# Altium schematic sheet Main_V1.1.SchDoc
size B
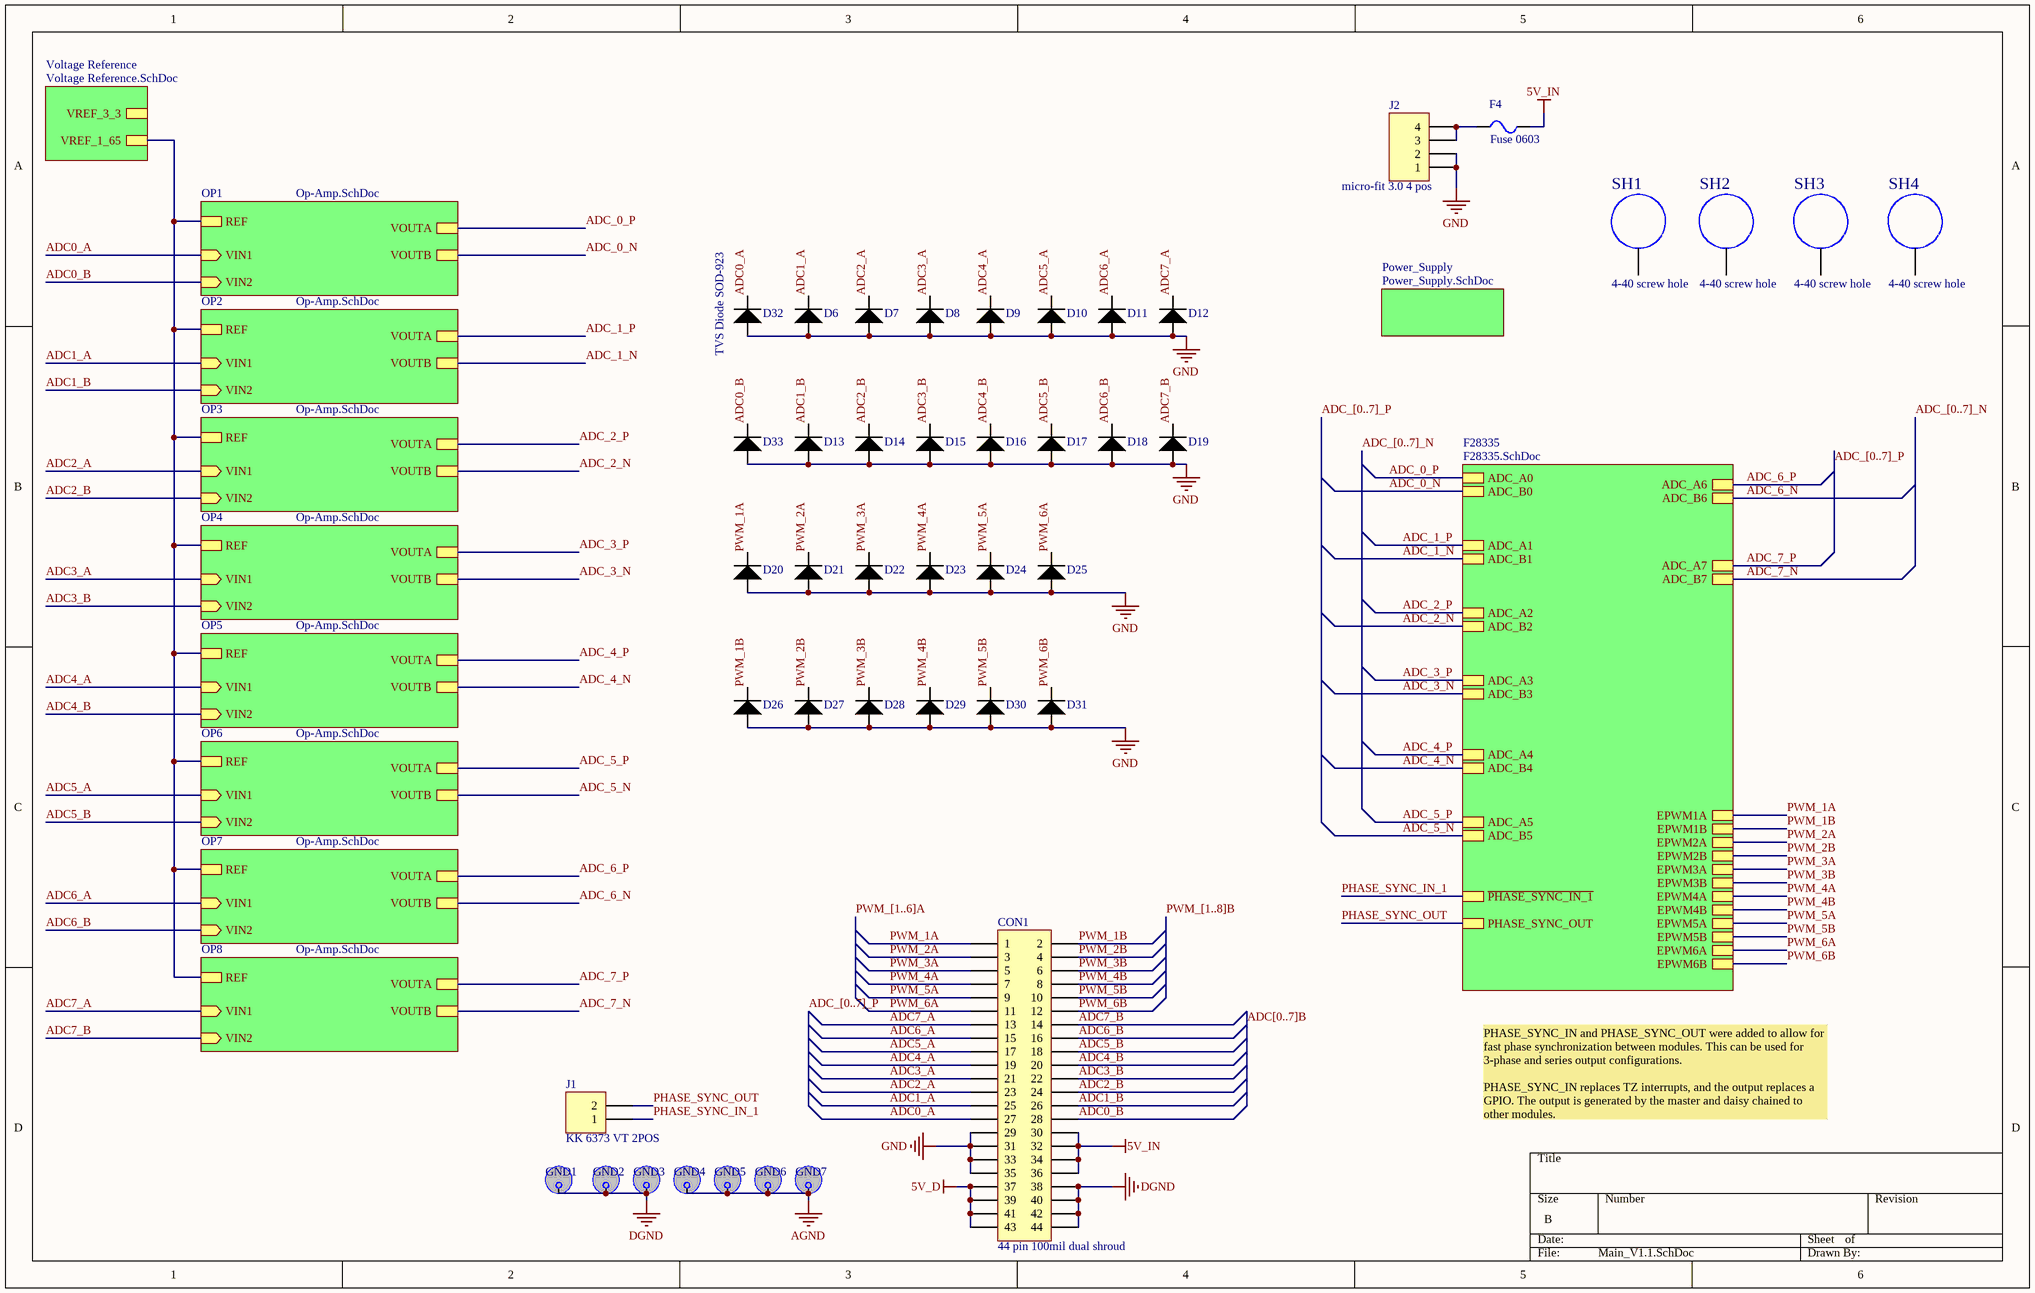
[diagram p0: Main_V1.1.SchDoc]

## Parts
CON1  44 pin 100mil dual shroud  [44 PIN 100 MIL DUAL UNSHROUD]
D6  TVS Diode SOD-923  [SOD-923-2]
D7  TVS Diode SOD-923  [SOD-923-2]  (value not drawn)
D8  TVS Diode SOD-923  [SOD-923-2]  (value not drawn)
D9  TVS Diode SOD-923  [SOD-923-2]  (value not drawn)
D10  TVS Diode SOD-923  [SOD-923-2]  (value not drawn)
D11  TVS Diode SOD-923  [SOD-923-2]  (value not drawn)
D12  TVS Diode SOD-923  [SOD-923-2]  (value not drawn)
D13  TVS Diode SOD-923  [SOD-923-2]  (value not drawn)
D14  TVS Diode SOD-923  [SOD-923-2]  (value not drawn)
D15  TVS Diode SOD-923  [SOD-923-2]  (value not drawn)
D16  TVS Diode SOD-923  [SOD-923-2]  (value not drawn)
D17  TVS Diode SOD-923  [SOD-923-2]  (value not drawn)
D18  TVS Diode SOD-923  [SOD-923-2]  (value not drawn)
D19  TVS Diode SOD-923  [SOD-923-2]  (value not drawn)
D20  TVS Diode SOD-923  [SOD-923-2]  (value not drawn)
D21  TVS Diode SOD-923  [SOD-923-2]  (value not drawn)
D22  TVS Diode SOD-923  [SOD-923-2]  (value not drawn)
D23  TVS Diode SOD-923  [SOD-923-2]  (value not drawn)
D24  TVS Diode SOD-923  [SOD-923-2]  (value not drawn)
D25  TVS Diode SOD-923  [SOD-923-2]  (value not drawn)
D26  TVS Diode SOD-923  [SOD-923-2]  (value not drawn)
D27  TVS Diode SOD-923  [SOD-923-2]  (value not drawn)
D28  TVS Diode SOD-923  [SOD-923-2]  (value not drawn)
D29  TVS Diode SOD-923  [SOD-923-2]  (value not drawn)
D30  TVS Diode SOD-923  [SOD-923-2]  (value not drawn)
D31  TVS Diode SOD-923  [SOD-923-2]  (value not drawn)
D32  TVS Diode SOD-923  [SOD-923-2]  (value not drawn)
D33  TVS Diode SOD-923  [SOD-923-2]  (value not drawn)
F4  Fuse 0603  [RES1608N]
GND1  *  [Keystone 5000]  (value not drawn)
GND2  *  [Keystone 5000]  (value not drawn)
GND3  *  [Keystone 5000]  (value not drawn)
GND4  *  [Keystone 5000]  (value not drawn)
GND5  *  [Keystone 5000]  (value not drawn)
GND6  *  [Keystone 5000]  (value not drawn)
GND7  *  [Keystone 5000]  (value not drawn)
J1  KK 6373 VT 2POS  [KK 6373 VT 2POS]
J2  micro-fit 3.0 4 pos  [micro-fit 3.0 4 pos dual line]
SH1  4-40 screw hole  [4-40 screw hole]
SH2  4-40 screw hole  [4-40 screw hole]
SH3  4-40 screw hole  [4-40 screw hole]
SH4  4-40 screw hole  [4-40 screw hole]

## Sub-sheets
F28335 = F28335.SchDoc: ADC_B0, ADC_B1, ADC_B2, ADC_B3, ADC_A0, ADC_A1, ADC_A2, ADC_A3, EPWM1A, EPWM1B, EPWM2A, EPWM2B, EPWM3A, EPWM3B, EPWM4A, EPWM4B, EPWM5A, EPWM5B, EPWM6A, EPWM6B, ADC_B4, ADC_A4, ADC_B5, ADC_A5, ~{PHASE_SYNC_IN_1}, PHASE_SYNC_OUT, ADC_A6, ADC_B6, ADC_B7, ADC_A7
OP1 = Op-Amp.SchDoc: VIN1 (in), VIN2 (in), VOUTA, VOUTB, REF
OP2 = Op-Amp.SchDoc: VIN1 (in), VIN2 (in), VOUTA, VOUTB, REF
OP3 = Op-Amp.SchDoc: VIN1 (in), VIN2 (in), VOUTA, VOUTB, REF
OP4 = Op-Amp.SchDoc: VIN1 (in), VIN2 (in), VOUTA, VOUTB, REF
OP5 = Op-Amp.SchDoc: VIN1 (in), VIN2 (in), VOUTA, VOUTB, REF
OP6 = Op-Amp.SchDoc: VIN1 (in), VIN2 (in), VOUTA, VOUTB, REF
OP7 = Op-Amp.SchDoc: VIN1 (in), VIN2 (in), VOUTA, VOUTB, REF
OP8 = Op-Amp.SchDoc: VIN1 (in), VIN2 (in), VOUTA, VOUTB, REF
Power_Supply = Power_Supply.SchDoc: no entries
Voltage Reference = Voltage Reference.SchDoc: VREF_1_65, VREF_3_3

## Nets
5V_D: CON1.37 CON1.39 CON1.41 CON1.43
5V_IN: CON1.30 CON1.32 CON1.34 CON1.36 F4.2
AGND: GND4.1 GND5.1 GND6.1 GND7.1
DGND: CON1.38 CON1.40 CON1.42 CON1.44 GND1.1 GND2.1 GND3.1
GND: CON1.29 CON1.31 CON1.33 CON1.35 D6.2(A) D7.2(A) D8.2(A) D9.2(A) D10.2(A) D11.2(A) D12.2(A) D13.2(A) D14.2(A) D15.2(A) D16.2(A) D17.2(A) D18.2(A) D19.2(A) D20.2(A) D21.2(A) D22.2(A) D23.2(A) D24.2(A) D25.2(A) D26.2(A) D27.2(A) D28.2(A) D29.2(A) D30.2(A) D31.2(A) D32.2(A) D33.2(A) J2.1 J2.2
ADC0_A: CON1.27 D32.1(C) ; sheet OP1/VIN1
ADC0_B: CON1.28 D33.1(C) ; sheet OP1/VIN2
ADC1_A: CON1.25 D6.1(C) ; sheet OP2/VIN1
ADC1_B: CON1.26 D13.1(C) ; sheet OP2/VIN2
ADC2_A: CON1.23 D7.1(C) ; sheet OP3/VIN1
ADC2_B: CON1.24 D14.1(C) ; sheet OP3/VIN2
ADC3_A: CON1.21 D8.1(C) ; sheet OP4/VIN1
ADC3_B: CON1.22 D15.1(C) ; sheet OP4/VIN2
ADC4_A: CON1.19 D9.1(C) ; sheet OP5/VIN1
ADC4_B: CON1.20 D16.1(C) ; sheet OP5/VIN2
ADC5_A: CON1.17 D10.1(C) ; sheet OP6/VIN1
ADC5_B: CON1.18 D17.1(C) ; sheet OP6/VIN2
ADC6_A: CON1.15 D11.1(C) ; sheet OP7/VIN1
ADC6_B: CON1.16 D18.1(C) ; sheet OP7/VIN2
ADC7_A: CON1.13 D12.1(C) ; sheet OP8/VIN1
ADC7_B: CON1.14 D19.1(C) ; sheet OP8/VIN2
ADC_0_N: sheet F28335/ADC_B0, sheet OP1/VOUTB
ADC_0_P: sheet F28335/ADC_A0, sheet OP1/VOUTA
ADC_1_N: sheet F28335/ADC_B1, sheet OP2/VOUTB
ADC_1_P: sheet F28335/ADC_A1, sheet OP2/VOUTA
ADC_2_N: sheet F28335/ADC_B2, sheet OP3/VOUTB
ADC_2_P: sheet F28335/ADC_A2, sheet OP3/VOUTA
ADC_3_N: sheet F28335/ADC_B3, sheet OP4/VOUTB
ADC_3_P: sheet F28335/ADC_A3, sheet OP4/VOUTA
ADC_4_N: sheet F28335/ADC_B4, sheet OP5/VOUTB
ADC_4_P: sheet F28335/ADC_A4, sheet OP5/VOUTA
ADC_5_N: sheet F28335/ADC_B5, sheet OP6/VOUTB
ADC_5_P: sheet F28335/ADC_A5, sheet OP6/VOUTA
ADC_6_N: sheet F28335/ADC_B6, sheet OP7/VOUTB
ADC_6_P: sheet F28335/ADC_A6, sheet OP7/VOUTA
ADC_7_N: sheet F28335/ADC_B7, sheet OP8/VOUTB
ADC_7_P: sheet F28335/ADC_A7, sheet OP8/VOUTA
PHASE_SYNC_IN_1: J1.1 ; sheet F28335/~{PHASE_SYNC_IN_1}
PHASE_SYNC_OUT: J1.2 ; sheet F28335/PHASE_SYNC_OUT
PWM_1A: CON1.1 D20.1(C) ; sheet F28335/EPWM1A
PWM_1B: CON1.2 D26.1(C) ; sheet F28335/EPWM1B
PWM_2A: CON1.3 D21.1(C) ; sheet F28335/EPWM2A
PWM_2B: CON1.4 D27.1(C) ; sheet F28335/EPWM2B
PWM_3A: CON1.5 D22.1(C) ; sheet F28335/EPWM3A
PWM_3B: CON1.6 D28.1(C) ; sheet F28335/EPWM3B
PWM_4A: CON1.7 D23.1(C) ; sheet F28335/EPWM4A
PWM_4B: CON1.8 D29.1(C) ; sheet F28335/EPWM4B
PWM_5A: CON1.9 D24.1(C) ; sheet F28335/EPWM5A
PWM_5B: CON1.10 D30.1(C) ; sheet F28335/EPWM5B
PWM_6A: CON1.11 D25.1(C) ; sheet F28335/EPWM6A
PWM_6B: CON1.12 D31.1(C) ; sheet F28335/EPWM6B
NetF4_1: F4.1 J2.3 J2.4
(unnamed): sheet OP1/REF, sheet Voltage Reference/VREF_1_65, sheet OP2/REF, sheet OP3/REF, sheet OP4/REF, sheet OP5/REF, sheet OP6/REF, sheet OP7/REF, sheet OP8/REF

Not connected (* = marked no-connect by the designer): SH1 1; SH2 1; SH3 1; SH4 1

## Buses and harness runs
bus ADC[0..7]B
bus ADC_[0..7]_N
bus ADC_[0..7]_P
bus PWM_[1..6]A
bus PWM_[1..8]B

## Notes on the sheet
- PHASE_SYNC_IN and PHASE_SYNC_OUT were added to allow for fast phase synchronization between modules. This can be used for 3-phase and series output configurations.
  PHASE_SYNC_IN replaces TZ interrupts, and the output replaces a GPIO. The output is generated by the master and daisy chained to other modules.

## Library data of the parts
CON1 = 44 pin 100mil dual shroud_1_1_1: 44 pin 100mil dual unshrouded header
GND1-GND7 = TEST_POINT_HOOK
J1 = KK 6373 VT 2POS: 1x2 Locking Header; Part#: WM4202-ND; Manuf: Molex/Waldom Electronics Corp; Vendor: DIGIKEY; Cost@10: 0.41; Manuf#: 22-23-2041
J2 = micro-fit 3.0 4 poS: Part#: 43045-0402; Manuf: Molex/Waldom Electronics Corp; Vendor: newark; Cost@10: 0.41; Manuf#: 22-23-2041